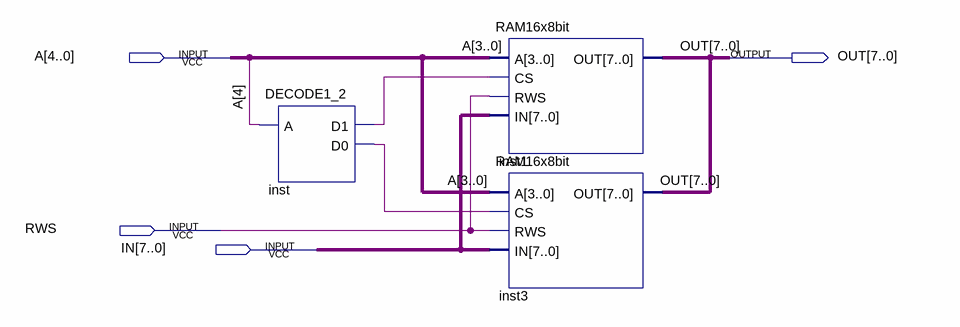
[diagram p0: schematic sheet]
// Quartus schematic RAM32x8bit.bdf as structural Verilog: 3 symbols, 4 pins
module RAM32x8bit (
  input  [4:0] A,
  input  RWS,
  input  [7:0] IN,
  output [7:0] OUT
);

  wire inst_d0, inst_d1;

  DECODE1_2 inst (.A(A[4]), .D1(inst_d1), .D0(inst_d0));
  RAM16x8bit inst1 (.A(A[3:0]), .CS(inst_d1), .RWS(RWS), .IN(IN), .OUT(OUT));
  RAM16x8bit inst3 (.A(A[3:0]), .CS(inst_d0), .RWS(RWS), .IN(IN), .OUT(OUT));
endmodule
